# Altium project Karakin6semPCB.PrjPcb
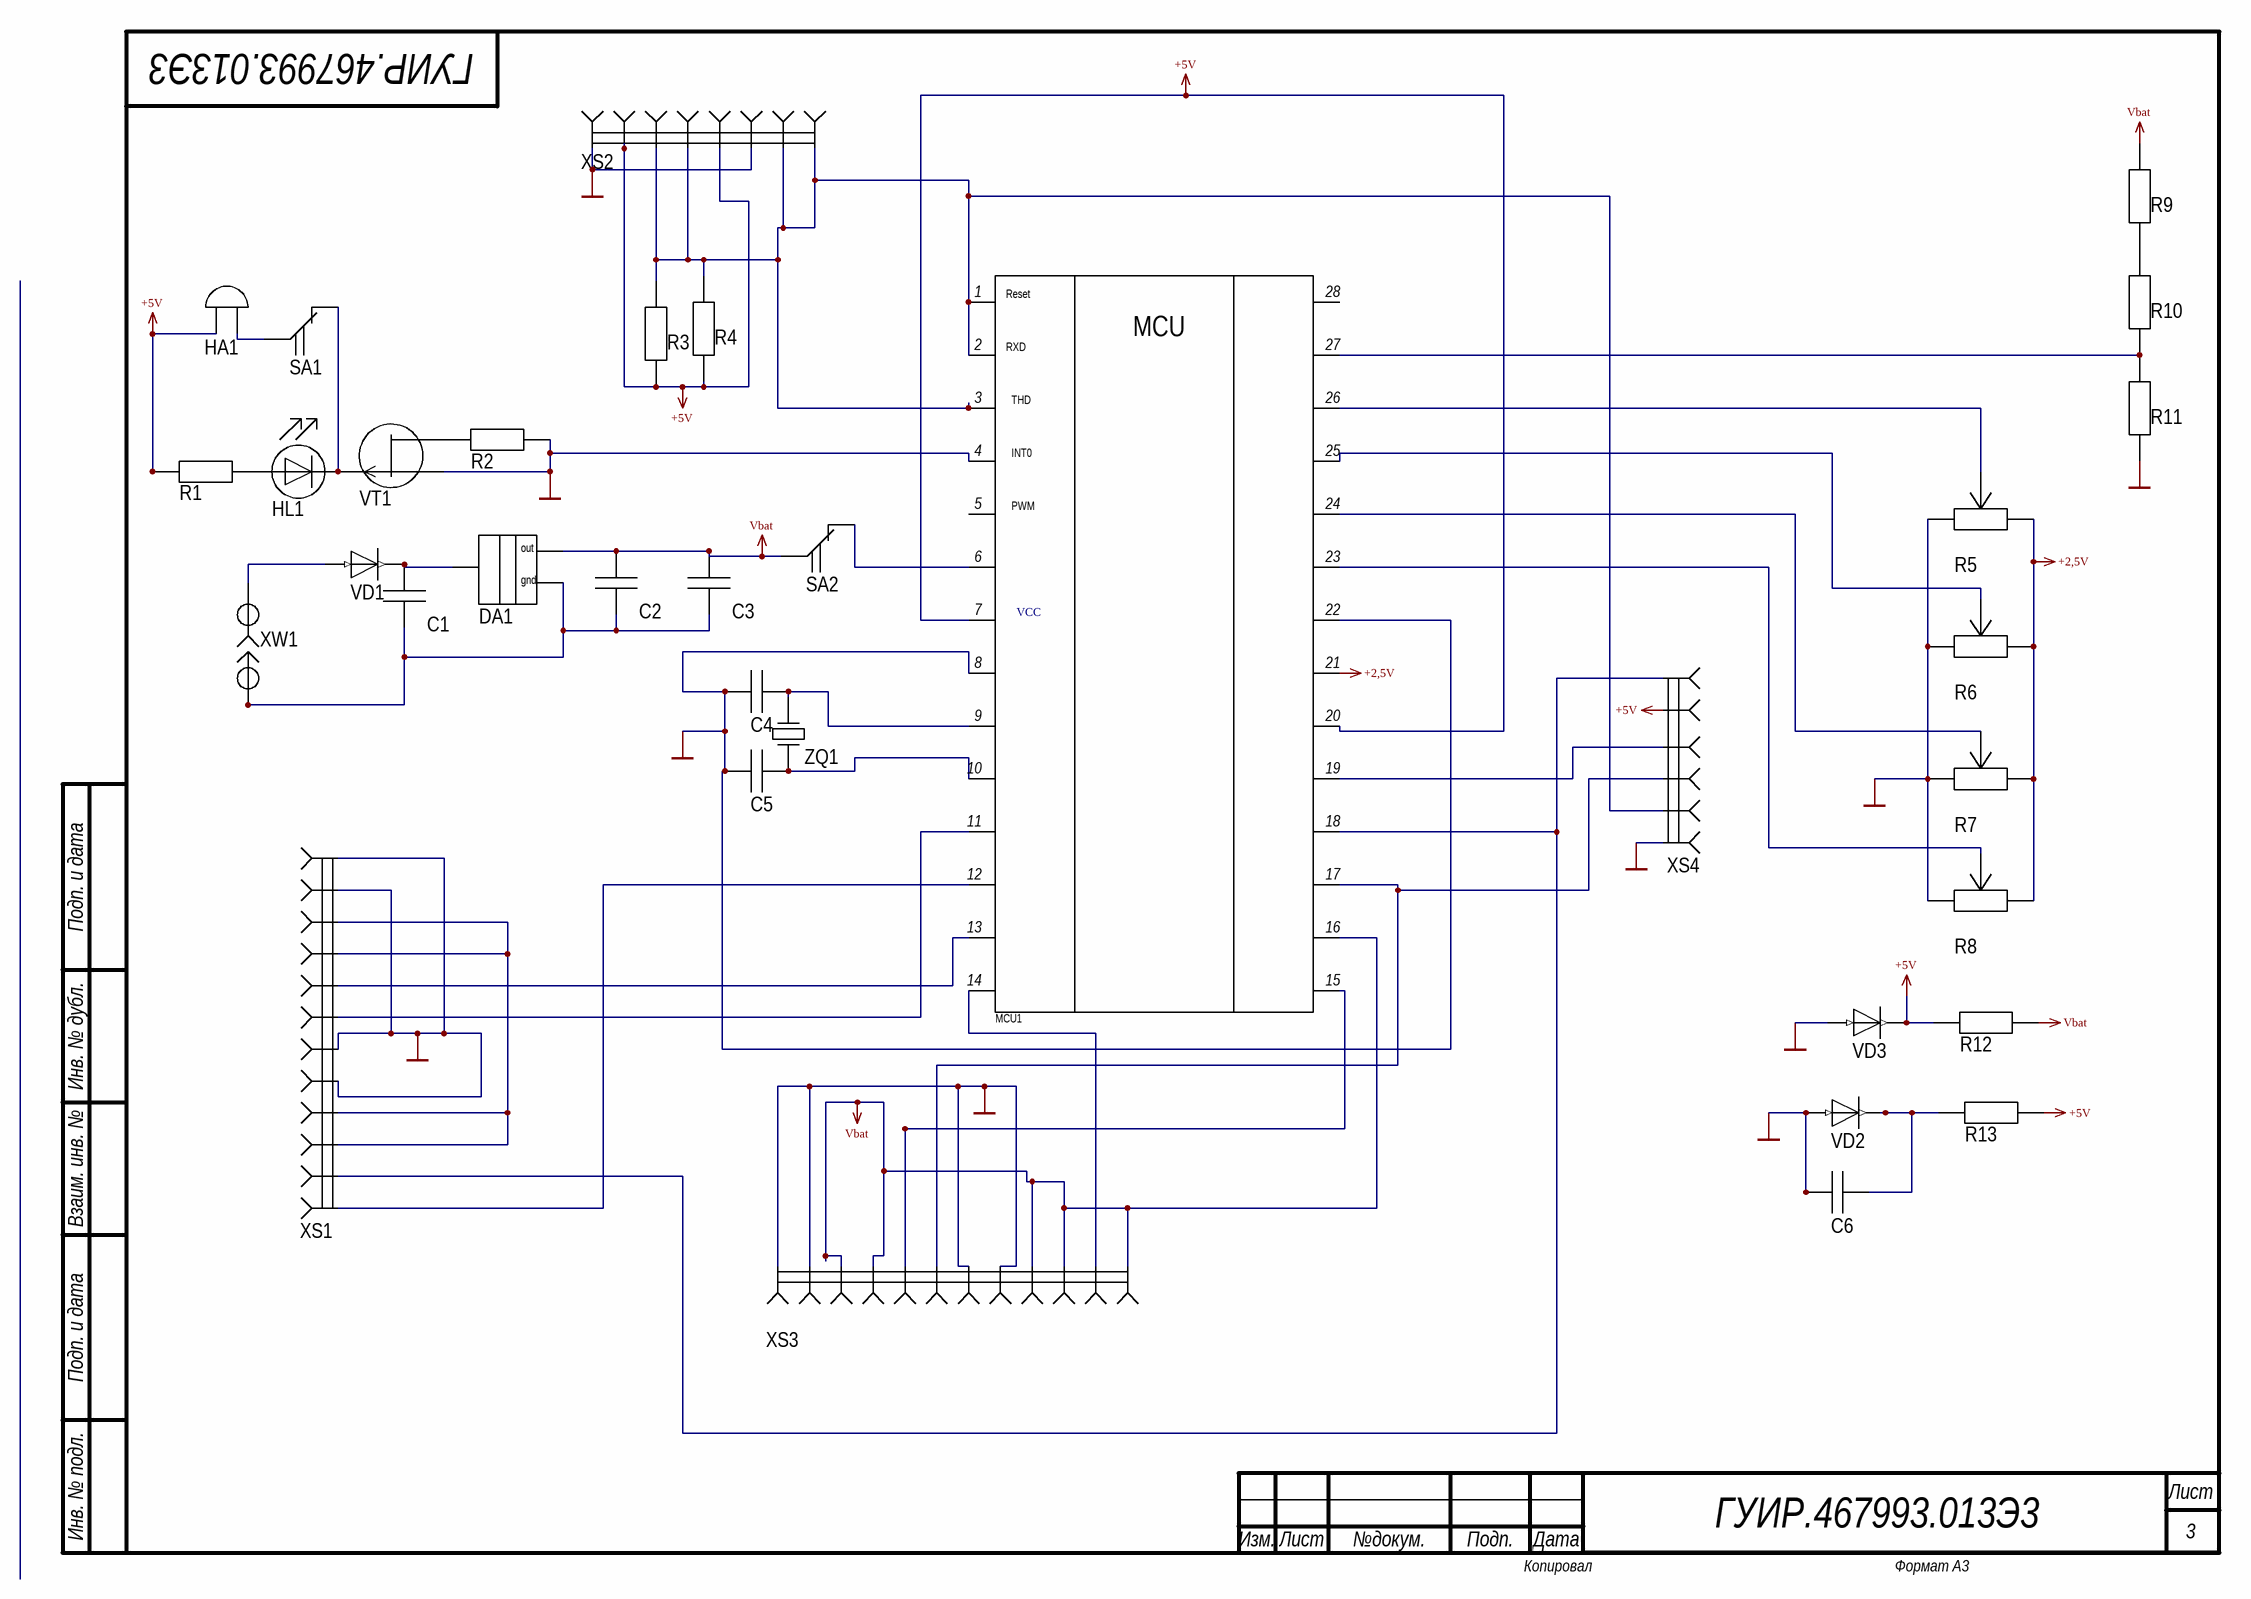
[diagram p0: SST.SchDoc]
1 sheet, 35 parts. Net scope: global (net labels, ports and power ports of the same name join across sheets).

## Sheet SST.SchDoc
size 420 x 297 mm; Author: creat by mr.anatas; SheetNumber: 1; SheetTotal: 1; _Oboznachenie: ГУИР.467993.013Э3; _Tip_dokumenta: Схема электрическая принципиальная; _List: 3; _Nazvanie3_verhnee: Система тестирования; _Nazvanie3_srednee: серпоприводов квадрокоптера; _Dopolnitelnye_grafy: -

### Parts
C1  Capacitor  (value not drawn)
C2  Capacitor  (value not drawn)
C3  Capacitor  (value not drawn)
C4  Capacitor  (value not drawn)
C5  Capacitor  (value not drawn)
C6  Capacitor  (value not drawn)
DA1  voltage-regulator  (value not drawn)
HA1  Zummer  (value not drawn)
HL1  LED  (value not drawn)
MCU1  (no value)
R1  Resistor  (value not drawn)
R2  Resistor  (value not drawn)
R3  Resistor  (value not drawn)
R4  Resistor  (value not drawn)
R5  potentiometer  (value not drawn)
R6  potentiometer  (value not drawn)
R7  potentiometer  (value not drawn)
R8  potentiometer  (value not drawn)
R9  Resistor  (value not drawn)
R10  Resistor  (value not drawn)
R11  Resistor  (value not drawn)
R12  Resistor  (value not drawn)
R13  Resistor  (value not drawn)
SA1  Switch  (value not drawn)
SA2  Switch  (value not drawn)
VD1  Diode  (value not drawn)
VD2  Diode  (value not drawn)
VD3  Diode  (value not drawn)
VT1  MOSFET  (value not drawn)
XS1  Сonnector12  (value not drawn)
XS2  Сonnector8  (value not drawn)
XS3  Сonnector12  (value not drawn)
XS4  Сonnector6  (value not drawn)
XW1  Сonnector_coaxial  (value not drawn)
ZQ1  Xtal  (value not drawn)

### Nets
+2,5V: MCU1.21 R5.2 R6.2 R7.2 R8.2
+5V: HA1.1 MCU1.7 MCU1.20 R1.1 R3.2 R4.1 R12.1 R13.2 VD3.2 XS2.4 XS2.8 XS4.5
GND: C4.1 C4.17 C5.1 C5.17 C6.1 C6.17 MCU1.4 MCU1.8 MCU1.22 R2.2 R5.1 R6.1 R7.1 R8.1 R11.2 VD2.1 VD3.1 VT1.3 XS1.1 XS1.2 XS2.3 XS2.7 XS3.1 XS3.2 XS4.1
Vbat: C2.1 C2.17 C3.1 C3.17 DA1.2 MCU1.16 R9.2 R12.2 SA2.1 XS3.3 XS3.4 XS3.6 XS3.7
NetC1_1: C1.1 C1.17 DA1.1 VD1.2
NetC1_2: C1.2 C2.2 C3.2 DA1.3 XW1.2
NetC4_2: C4.2 MCU1.9 ZQ1.2
NetC5_2: C5.2 MCU1.10 ZQ1.1
NetC6_2: C6.2 R13.1 VD2.2
NetHA1_2: HA1.2 SA1.1
NetHL1_1: HL1.1 R1.2
NetHL1_2: HL1.2 SA1.2 VT1.1
NetMCU1_1: MCU1.1 MCU1.2 MCU1.3 R3.1 R4.2 XS2.1 XS2.2 XS2.5 XS2.6 XS4.2
NetMCU1_6: MCU1.6 SA2.2
NetMCU1_11: MCU1.11 XS1.6
NetMCU1_12: MCU1.12 XS1.6
NetMCU1_13: MCU1.13 XS1.5
NetMCU1_14: MCU1.14 XS3.5
NetMCU1_15: MCU1.15 XS3.5
NetMCU1_17: MCU1.17 XS3.6 XS4.3
NetMCU1_18: MCU1.18 XS1.5 XS4.6
NetMCU1_19: MCU1.19 XS4.4
NetMCU1_23: MCU1.23 R8.3
NetMCU1_24: MCU1.24 R7.3
NetMCU1_25: MCU1.25 R6.3
NetMCU1_26: MCU1.26 R5.3
NetMCU1_27: MCU1.27 R10.1 R11.1
NetR2_1: R2.1 VT1.2
NetR9_1: R9.1 R10.2
NetVD1_1: VD1.1 XW1.1
NetXS1_3: XS1.3 XS1.4 XS1.7

Not connected (* = marked no-connect by the designer): MCU1 5 28

### Notes on the sheet
- Подп. и дата
- Инв. № дубл.
- Взаим. инв. №
- Инв. № подл.
- Изм.
- Лист
- №докум.
- Подп.
- Дата
- Копировал
- Формат A3
- (in symbol Microcontroller) Reset; MCU; RXD; THD; INT0; PWM; VCC
- (in symbol voltage-regulator) out; IN; gnd

### Library data of the parts
MCU1 = Microcontroller
SA1 SA2 = Switch: Переключатели ползунковые 2П1Н
VT1 = MOSFET: Полевой с пэ каналом
ZQ1 = Xtal: Резонатор кварцевый